# Altium schematic sheet Charge.schdoc
size 497 x 243 mm; Name: A_A4; Symbol: A_A4; Device: A_A4; @Project Name: Charge; REV: 1.0; Date: 2022-09-09; Sheet: 1/1; Draw By: timp2100; Company: BUAA; Convert to PCB: yes; Add into BOM: yes
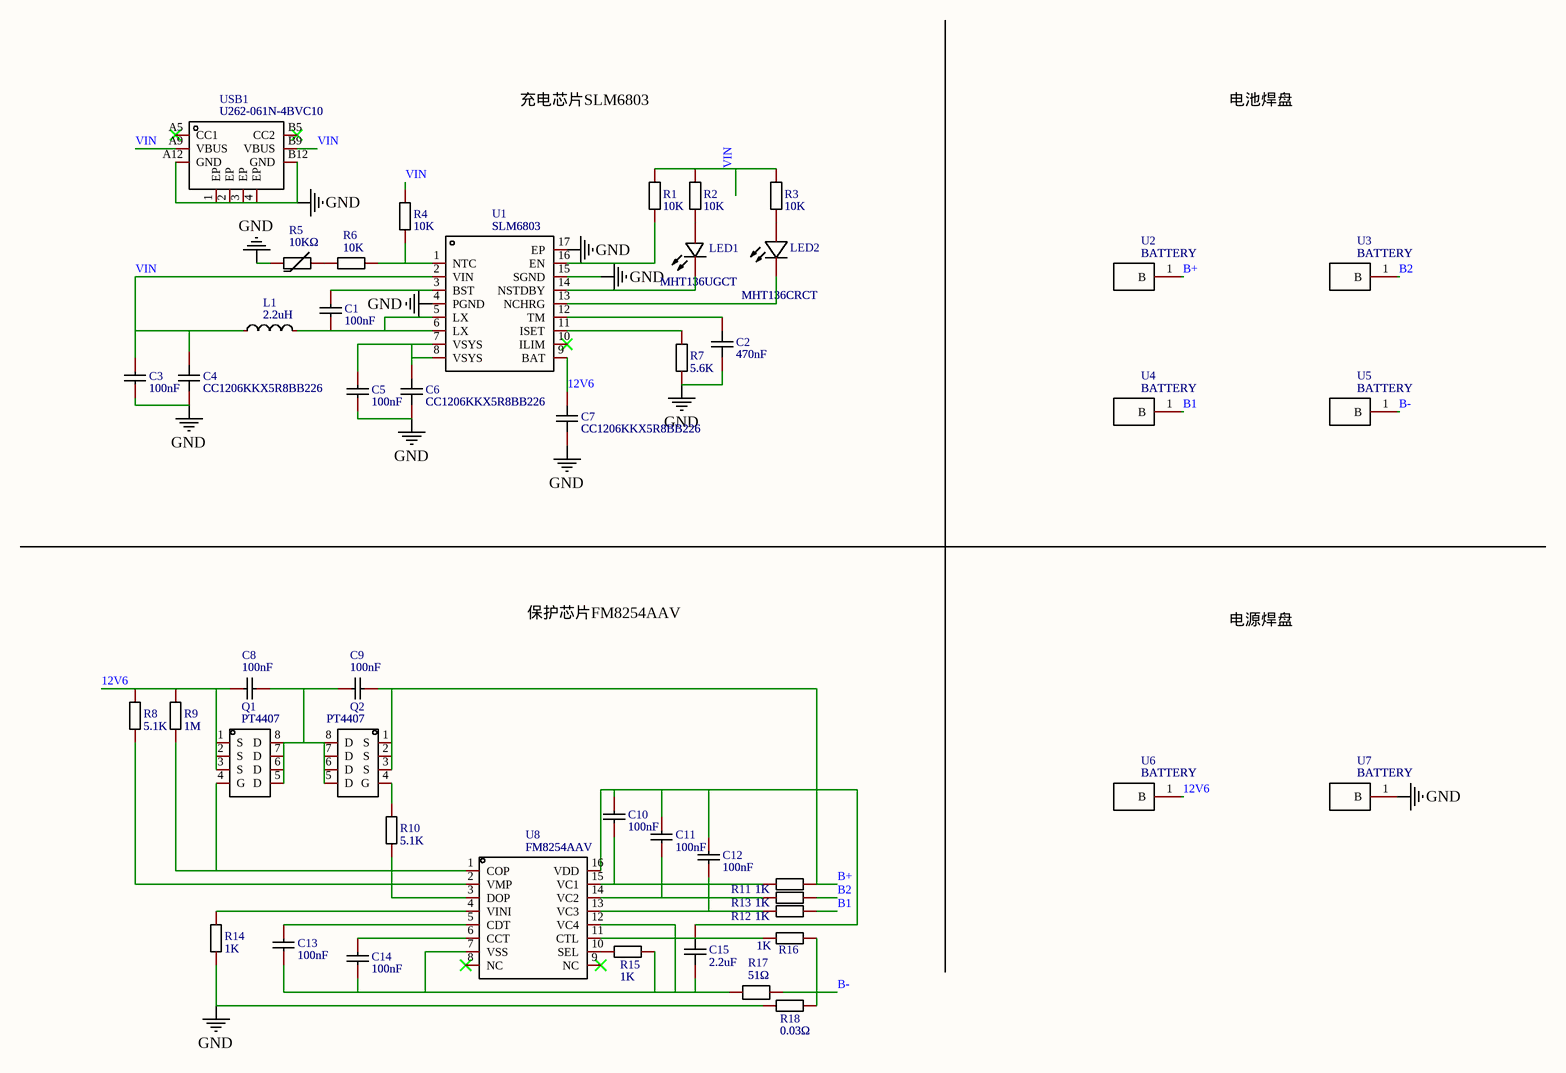
[diagram p0: Charge.schdoc]

## Parts
C1  100nF  [C0402]
C2  470nF  [C0402]
C3  100nF  [C0402]
C4  CC1206KKX5R8BB226  [C1206]
C5  100nF  [C0402]
C6  CC1206KKX5R8BB226  [C1206]
C7  CC1206KKX5R8BB226  [C1206]
C8  100nF  [C0402]
C9  100nF  [C0402]
C10  100nF  [C0402]
C11  100nF  [C0402]
C12  100nF  [C0402]
C13  100nF  [C0402]
C14  100nF  [C0402]
C15  2.2uF  [C0402]
L1  2.2uH  [IND-SMD_L10.8-W10.0]
LED1  MHT136UGCT  [LED0402-RD]
LED2  MHT136CRCT  [LED0402-RD]
Q1  PT4407  [SOP-8_L5.0-W4.0-P1.27-LS6.0-BL]
Q2  PT4407  [SOP-8_L5.0-W4.0-P1.27-LS6.0-BL]
R1  10K  [R0402]
R2  10K  [R0402]
R3  10K  [R0402]
R4  10K  [R0402]
R5  10KΩ  [R0805]
R6  10K  [R0402]
R7  5.6K  [R0402]
R8  5.1K  [R0402]
R9  1M  [R0402]
R10  5.1K  [R0402]
R11  1K  [R0402]
R12  1K  [R0402]
R13  1K  [R0402]
R14  1K  [R0402]
R15  1K  [R0402]
R16  1K  [R0402]
R17  51Ω  [R0603]
R18  0.03Ω  [R2512]
U1  SLM6803  [QFN-16_L4.0-W4.0-P0.65-BL-EP2.2]
U2  BATTERY  [BATTERY]
U3  BATTERY  [BATTERY]
U4  BATTERY  [BATTERY]
U5  BATTERY  [BATTERY]
U6  BATTERY  [BATTERY]
U7  BATTERY  [BATTERY]
U8  FM8254AAV  [TSSOP-16_L5.0-W4.4-P0.65-LS6.4-BL]
USB1  U262-061N-4BVC10  [TYPE-C-SMD_TYPE-C-31-M-16]

## Nets
GND: C2.1 C3.1 C4.1 C5.1 C6.1 C7.1 R5.1 R7.1 R14.1 R18.1 U1.4(PGND) U1.15(SGND) U1.17(EP) U7.1(B) USB1.1(EP) USB1.2(EP) USB1.3(EP) USB1.4(EP) USB1.A12(GND) USB1.B12(GND)
12V6: C7.2 C8.2 Q1.1(S) Q1.2(S) Q1.3(S) R8.2 R9.2 U1.9(BAT) U6.1(B)
B1: R12.1 U4.1(B)
B2: R13.1 U3.1(B)
B+: C9.1 C10.1 C11.1 C12.1 C15.2 Q2.1(S) Q2.2(S) Q2.3(S) R11.1 U2.1(B) U8.16(VDD)
B-: R16.1 R17.2 R18.2 U5.1(B)
VIN: C3.2 C4.2 L1.1 R1.2 R2.2 R3.2 R4.2 U1.2(VIN) USB1.A9(VBUS) USB1.B9(VBUS)
NetC1_1: C1.1 L1.2 U1.5(LX) U1.6(LX)
NetC1_2: C1.2 U1.3(BST)
NetC2_2: C2.2 U1.12(TM)
NetC5_2: C5.2 C6.2 U1.7(VSYS) U1.8(VSYS)
NetC8_1: C8.1 C9.2 Q1.5(D) Q1.6(D) Q1.7(D) Q1.8(D) Q2.5(D) Q2.6(D) Q2.7(D) Q2.8(D)
NetC10_2: C10.2 R11.2 U8.15(VC1)
NetC11_2: C11.2 R13.2 U8.14(VC2)
NetC12_2: C12.2 R12.2 U8.13(VC3)
NetC13_1: C13.1 C14.1 C15.1 R15.1 R17.1 U8.7(VSS) U8.12(VC4)
NetC13_2: C13.2 U8.5(CDT)
NetC14_2: C14.2 U8.6(CCT)
NetLED1_1: LED1.1(-) U1.14(NSTDBY)
NetLED1_2: LED1.2(+) R2.1
NetLED2_1: LED2.1(K) U1.13(NCHRG)
NetLED2_2: LED2.2(A) R3.1
NetQ1_4: Q1.4(G) R9.1 U8.1(COP)
NetQ2_4: Q2.4(G) R10.2
NetR1_1: R1.1 U1.16(EN)
NetR4_1: R4.1 R6.1 U1.1(NTC)
NetR5_2: R5.2 R6.2
NetR7_2: R7.2 U1.11(ISET)
NetR8_1: R8.1 U8.2(VMP)
NetR10_1: R10.1 U8.3(DOP)
NetR14_2: R14.2 U8.4(VINI)
NetR15_2: R15.2 U8.10(SEL)
NetR16_2: R16.2 U8.11(CTL)

Not connected (* = marked no-connect by the designer): U1 10(ILIM)*; U8 8(NC)* 9(NC)*; USB1 A5(CC1)* B5(CC2)*

## Notes on the sheet
- 充电芯片SLM6803
- 电池焊盘
- 保护芯片FM8254AAV
- 电源焊盘
- 1
- 2
- 3
- 4
- 5
- A
- B
- C
- D
- TITLE:
- Charge
- REV:
- 1.0
- Date:
- Company:
- 2022-09-09
- BUAA
- Drawn By:
- timp2100
- Sheet:
- 1/1

## Library data of the parts
C1 C3 C5 C8-C14 = 100nF: Manufacturer: YAGEO; Manufacturer Part: CC0402KRX5R8BB104; 3DModel: C0402_L1.0-W0.5-H0.5; Add into BOM: yes; Name: 100nF; Symbol: 100nF; Device: 100nF; link: https://item.szlcsc.com/15869.html; Supplier: LCSC; Supplier Part: C106256; JLCPCB Part Class: Extended Part; Convert to PCB: yes; Origin Footprint: C0402
C2 = 470nF: Manufacturer: YAGEO; Manufacturer Part: CC0402KRX5R8BB474; 3DModel: C0402_L1.0-W0.5-H0.5; Add into BOM: yes; Name: 470nF; Symbol: 470nF; Device: 470nF; link: https://item.szlcsc.com/15869.html; Supplier: LCSC; Supplier Part: C541475; JLCPCB Part Class: Extended Part; Convert to PCB: yes; Origin Footprint: C0402
C4 C6 C7 = CC1206KKX5R8BB226: Manufacturer: YAGEO(国巨); 3DModel: C1206_L3.2-W1.6-H1.3; Capacitance: 22uF; Add into BOM: yes; Name: CC1206KKX5R8BB226; Symbol: CC1206KKX5R8BB226; Device: CC1206KKX5R8BB226; link: https://item.szlcsc.com/89171.html; Supplier: LCSC; Supplier Part: C2178233; Manufacturer Part: CC1206KKX5R8BB226; JLCPCB Part Class: Extended Part; Convert to PCB: yes; Origin Footprint: C1206
C15 = 2.2uF: Manufacturer: YAGEO; Manufacturer Part: CC0402KRX5R8BB225; 3DModel: C0402_L1.0-W0.5-H0.5; Add into BOM: yes; Name: 2.2uF; Symbol: 2.2uF; Device: 2.2uF; link: https://item.szlcsc.com/15869.html; Supplier: LCSC; Supplier Part: C723363; JLCPCB Part Class: Extended Part; Convert to PCB: yes; Origin Footprint: C0402
L1 = 2.2uH: Manufacturer: Sunltech Tech; Manufacturer Part: SLO1040H2R2MTT; 3DModel: IND-SMD_L10.8-W10.0-H4.0; Add into BOM: yes; Name: 2.2uH; Symbol: 2.2uH; Device: 2.2uH; link: https://item.szlcsc.com/208921.html; Supplier: LCSC; Supplier Part: C207849; JLCPCB Part Class: Extended Part; Convert to PCB: yes; Origin Footprint: IND-SMD_L10.8-W10.0
LED1 = MHT136UGCT: Manufacturer: MEIHUA; 3DModel: LED0402_L1.0-W0.5-H0.2; Add into BOM: yes; Name: MHT136UGCT; Symbol: MHT136UGCT; Device: MHT136UGCT; link: https://item.szlcsc.com/385873.html; Supplier: LCSC; Supplier Part: C409787; Manufacturer Part: MHT136UGCT; JLCPCB Part Class: Extended Part; Convert to PCB: yes; Origin Footprint: LED0402-RD
LED2 = MHT136CRCT: Manufacturer: MEIHUA; 3DModel: LED0402_L1.0-W0.5-H0.2; Add into BOM: yes; Name: MHT136CRCT; Symbol: MHT136CRCT; Device: MHT136CRCT; link: https://item.szlcsc.com/385873.html; Supplier: LCSC; Supplier Part: C397045; Manufacturer Part: MHT136CRCT; JLCPCB Part Class: Extended Part; Convert to PCB: yes; Origin Footprint: LED0402-RD
Q1 Q2 = PT4407: Manufacturer: PUOLOP; 3DModel: SOP-8_L5.0-W4.0-H1.8-LS6.2-P1.27; Add into BOM: yes; Name: PT4407; Symbol: PT4407; Device: PT4407; link: https://item.szlcsc.com/7378.html; Supplier: LCSC; Supplier Part: C351418; Manufacturer Part: PT4407; JLCPCB Part Class: Extended Part; Convert to PCB: yes; Origin Footprint: SOP-8_L5.0-W4.0-P1.27-LS6.0-BL
R1-R4 R6 = 10K: Manufacturer: YAGEO; Manufacturer Part: RC0402FR-0710KL; 3DModel: R0402_L1.0-W0.5-H0.5; Resistance: 10kΩ; Add into BOM: yes; Name: 10K; Symbol: 10K; Device: 10K; link: https://item.szlcsc.com/323315.html; Supplier: LCSC; Supplier Part: C60490; JLCPCB Part Class: Extended Part; Convert to PCB: yes; Origin Footprint: R0402
R5 = 10KΩ: Manufacturer: Sunlord; Manufacturer Part: SDNT2012X103J3450HTF; 3DModel: R0805_L2.0-W1.3-H0.6; Add into BOM: yes; Name: 10KΩ; Symbol: 10KΩ; Device: 10KΩ; link: https://item.szlcsc.com/142685.html; Supplier: LCSC; Supplier Part: C98548; JLCPCB Part Class: Extended Part; Convert to PCB: yes; Origin Footprint: R0805
R7 = 5.6K: Manufacturer: YAGEO; Manufacturer Part: RC0402FR-075K6L; 3DModel: R0402_L1.0-W0.5-H0.5; Resistance: 5.6kΩ; Add into BOM: yes; Name: 5.6K; Symbol: 5.6K; Device: 5.6K; link: https://item.szlcsc.com/323315.html; Supplier: LCSC; Supplier Part: C163457; JLCPCB Part Class: Extended Part; Convert to PCB: yes; Origin Footprint: R0402
R8 R10 = 5.1K: Manufacturer: YAGEO; Manufacturer Part: RC0402FR-075K1L; 3DModel: R0402_L1.0-W0.5-H0.5; Resistance: 5.1kΩ; Add into BOM: yes; Name: 5.1K; Symbol: 5.1K; Device: 5.1K; link: https://item.szlcsc.com/323315.html; Supplier: LCSC; Supplier Part: C105872; JLCPCB Part Class: Extended Part; Convert to PCB: yes; Origin Footprint: R0402
R9 = 1M: Manufacturer: YAGEO; Manufacturer Part: RC0402FR-071ML; 3DModel: R0402_L1.0-W0.5-H0.5; Resistance: 1MΩ; Add into BOM: yes; Name: 1M; Symbol: 1M; Device: 1M; link: https://item.szlcsc.com/323315.html; Supplier: LCSC; Supplier Part: C138033; JLCPCB Part Class: Extended Part; Convert to PCB: yes; Origin Footprint: R0402
R11-R16 = 1K: Manufacturer: YAGEO; Manufacturer Part: AC0402FR-071KL; 3DModel: R0402_L1.0-W0.5-H0.5; Resistance: 1kΩ; Add into BOM: yes; Name: 1K; Symbol: 1K; Device: 1K; link: https://item.szlcsc.com/323315.html; Supplier: LCSC; Supplier Part: C144789; JLCPCB Part Class: Extended Part; Convert to PCB: yes; Origin Footprint: R0402
R17 = 51Ω: Manufacturer: ROHM(罗姆); Manufacturer Part: ESR03EZPF51R0; 3DModel: R0603_L1.6-W0.8-H0.8; Add into BOM: yes; Name: 51Ω; Symbol: 51Ω; Device: 51Ω; link: https://www.mouser.in/datasheet/2/447/PYu_RT_1_to_0_01_RoHS_L_11-1669912.pdf; Supplier: LCSC; Supplier Part: C2074217; JLCPCB Part Class: Extended Part; Convert to PCB: yes; Origin Footprint: R0603
R18 = 0.03Ω: Manufacturer: PSA; Manufacturer Part: FMF25FPJR030-LHL; 3DModel: R2512_L6.3-W3.2-H0.6; Resistance: 0.03; Add into BOM: yes; Name: 0.03Ω; Symbol: 0.03Ω; Device: 0.03Ω; link: https://item.szlcsc.com/347967.html; Supplier: LCSC; Supplier Part: C105394; JLCPCB Part Class: Extended Part; Convert to PCB: yes; Origin Footprint: R2512
U1 = SLM6803: Manufacturer: SOLA-IC; 3DModel: QFN-16_L4.0-W4.0-H1.0-P0.65; Add into BOM: yes; Name: SLM6803; Symbol: SLM6803; Device: SLM6803; link: https://item.szlcsc.com/17890.html; Supplier: LCSC; Supplier Part: C711587; Manufacturer Part: SLM6803; JLCPCB Part Class: Extended Part; Convert to PCB: yes; Origin Footprint: QFN-16_L4.0-W4.0-P0.65-BL-EP2.2
U2-U7 = BATTERY: Add into BOM: yes; Name: BATTERY; Symbol: BATTERY; Device: BATTERY; Convert to PCB: yes; Origin Footprint: BATTERY
U8 = FM8254AAV: Manufacturer: Shenzhen Fuman Elec; 3DModel: TSSOP-16_L5.0-W4.4-H1.0-LS6.4-P0.65; Add into BOM: yes; Name: FM8254AAV; Symbol: FM8254AAV; Device: FM8254AAV; link: https://item.szlcsc.com/6534.html; Supplier: LCSC; Supplier Part: C255540; Manufacturer Part: FM8254AAV; JLCPCB Part Class: Extended Part; Convert to PCB: yes; Origin Footprint: TSSOP-16_L5.0-W4.4-P0.65-LS6.4-BL
USB1 = U262-061N-4BVC10: Manufacturer: XKB Connectivity; 3DModel: TYPE-C-SMD_6P-L8.9-W6.8-H3.2-P1.00; Add into BOM: yes; Name: U262-061N-4BVC10; Symbol: U262-061N-4BVC10; Device: U262-061N-4BVC10; link: https://item.szlcsc.com/269352.html; Supplier: LCSC; Supplier Part: C692420; Manufacturer Part: U262-061N-4BVC10; JLCPCB Part Class: Extended Part; Convert to PCB: yes; Origin Footprint: TYPE-C-SMD_TYPE-C-31-M-16